# Altium schematic sheet PoE.SchDoc: Power Over Ethernet 3W
size A4; Date: 29-OCT-2015; Author: A.B; CompanyName: STMicroelectronics; Organization: MCD/TOOLS/GNB; Address1: 12, Rue Jules HOROWITZ; Address2: 38019 Grenoble; Address3: FRANCE; DocumentNumber: MB1225; Revision: B-01; SheetNumber: 11; SheetTotal: 13; Project: STM32F769I-DISCO
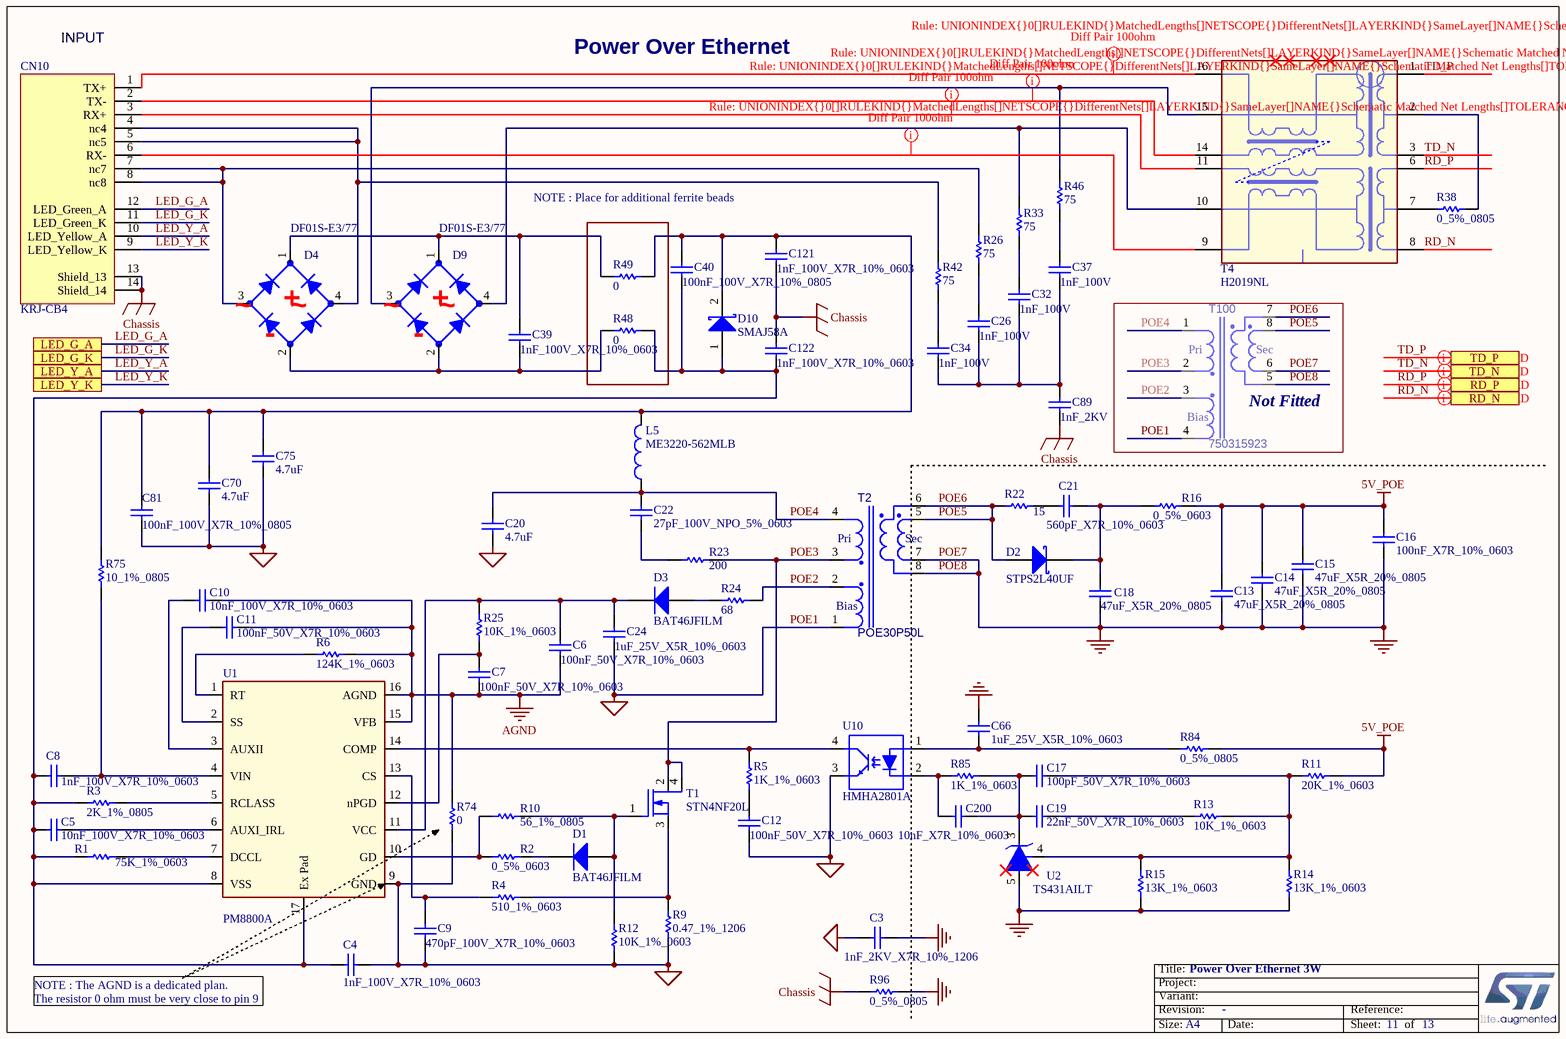
[diagram p0: PoE.SchDoc]

## Parts
C3  1nF_2KV_X7R_10%_1206  [1206C]
C4  1nF_100V_X7R_10%_0603  [0603C]
C5  10nF_100V_X7R_10%_0603  [0603C]
C6  100nF_50V_X7R_10%_0603  [0603C]
C7  100nF_50V_X7R_10%_0603  [0603C]
C8  1nF_100V_X7R_10%_0603  [0603C]
C9  470pF_100V_X7R_10%_0603  [0603C]
C10  10nF_100V_X7R_10%_0603  [0603C]
C11  100nF_50V_X7R_10%_0603  [0603C]
C12  100nF_50V_X7R_10%_0603  [0603C]
C13  47uF_X5R_20%_0805  [0805C]
C14  47uF_X5R_20%_0805  [0805C]
C15  47uF_X5R_20%_0805  [0805C]
C16  100nF_X7R_10%_0603  [0603C]
C17  100pF_50V_X7R_10%_0603  [0603C]
C18  47uF_X5R_20%_0805  [0805C]
C19  22nF_50V_X7R_10%_0603  [0603C]
C20  value 4.7uF  [C1210_H2P5]  (hidden comment: Capacitor)
C21  560pF_X7R_10%_0603  [0603C]
C22  27pF_100V_NPO_5%_0603  [0603C]
C24  1uF_25V_X5R_10%_0603  [0603C]
C26  1nF_100V  [0603C]
C32  1nF_100V  [0603C]
C34  1nF_100V  [0603C]
C37  1nF_100V  [0603C]
C39  1nF_100V_X7R_10%_0603  [0603C]
C40  100nF_100V_X7R_10%_0805  [0805C]
C66  1uF_25V_X5R_10%_0603  [0603C]
C70  value 4.7uF  [C1210_H2P5]  (hidden comment: Capacitor)
C75  value 4.7uF  [C1210_H2P5]  (hidden comment: Capacitor)
C81  100nF_100V_X7R_10%_0805  [0805C]
C89  1nF_2KV  [1206C]
C121  1nF_100V_X7R_10%_0603  [0603C]
C122  1nF_100V_X7R_10%_0603  [0603C]
C200  10nF_X7R_10%_0603  [0603C]
CN10  KRJ-CB4  [RJ45_LED_KRJ-CB4R2GYZNL_EM]
D1  BAT46JFILM  [SOD-323]
D2  STPS2L40UF  [SMB]
D3  BAT46JFILM  [SOD-323]
D4  value DF01S-E3/77  [BRF_VISHAY_DFS_DF01S]
D9  value DF01S-E3/77  [BRF_VISHAY_DFS_DF01S]
D10  SMAJ58A  [SMA]
L5  ME3220-562MLB  [LSM2_3R2X2R8_H2]
R1  75K_1%_0603  [0603R]
R2  0_5%_0603  [0603R-GS]
R3  2K_1%_0805  [0805R]
R4  510_1%_0603  [0603R]
R5  1K_1%_0603  [0603R]
R6  124K_1%_0603  [0603R]
R9  0.47_1%_1206  [1206R]
R10  56_1%_0805  [0805R]
R11  20K_1%_0603  [0603R]
R12  10K_1%_0603  [0603R]
R13  10K_1%_0603  [0603R]
R14  13K_1%_0603  [0603R]
R15  13K_1%_0603  [0603R]
R16  0_5%_0603  [0603R-GS]
R22  15  [0805R]
R23  200  [1206R]
R24  68  [0805R]
R25  10K_1%_0603  [0603R]
R26  75  [0805R]
R33  75  [0805R]
R38  0_5%_0805  [0805R]
R42  75  [0805R]
R46  75  [0805R]
R48  0  [0805R]
R49  0  [0805R]
R74  0  [0603R-GS]
R75  10_1%_0805  [0805R]
R84  0_5%_0805  [0805R]
R85  1K_1%_0603  [0603R]
R96  0_5%_0805  [0805R]
T1  STN4NF20L  [SOT-223]
T2  POE30P50L  [TF_10R9X13R2-12R2X14R4_CPT]
T4  H2019NL  [TF_16SM_12R7X9R65]
T100  750315923  [TF_8SM_12R04X12R85]
U1  PM8800A  [TSSOP16_0R65_5x6R4_TP]
U2  TS431AILT  [SOT23-5]
U10  HMHA2801A  [PC_4SM_1R27_2R5X6R8]

## Blocks framed on the sheet
Not Fitted: T100

## Ports
LED_G_A, LED_G_K, LED_Y_A, LED_Y_K, RD_N, RD_P, TD_N, TD_P

## Nets
5V_POE: C13.2 C14.2 C15.2 C16.2 R11.2 R16.2 R84.2
AGND: C6.1 C7.1 C10.2 C11.2 R6.2 R74.2 U1.15(VFB) U1.16(AGND)
Chassis: C89.1 C121.1 C122.2 CN10.13(Shield_13) CN10.14(Shield_14) R96.1
POE1: C3.1 C4.2 C9.1 C12.1 C20.1 C24.1 C70.1 C75.1 C81.1 R9.1 R12.1 R74.1 T2.1 T100.4 U1.9(GND) U10.3(Emitter)  [also labelled GND_POWER_IN]
POE7: C3.2 C13.1 C14.1 C15.1 C16.1 C18.1 C66.2 R14.1 R15.1 R96.2 T2.7 T2.8 T100.5 T100.6 U2.5(A)  [also labelled GND, POE8]
LED_G_A: CN10.12(LED_Green_A) ; port LED_G_A
LED_G_K: CN10.11(LED_Green_K) ; port LED_G_K
LED_Y_A: CN10.10(LED_Yellow_A) ; port LED_Y_A
LED_Y_K: CN10.9(LED_Yellow_K) ; port LED_Y_K
POE2: R24.2 T2.2 T100.3
POE3: R23.2 T1.2(D) T1.4(D) T2.3 T100.2
POE4: C20.2 C22.2 L5.1 T2.4 T100.1
POE5: D2.1(A) R22.1 T2.5 T2.6 T100.7 T100.8  [also labelled POE6]
RD_N: T4.8(rd-) ; port RD_N
RD_P: T4.6(rd+) ; port RD_P
TD_N: T4.3(td-) ; port TD_N
TD_P: T4.1(td+) ; port TD_P
NetC4_1: C4.1 C5.1 C8.1 C40.1 C122.1 D10.1(A) R1.1 R3.1 R48.2 U1.8(VSS) U1.17(Ex_Pad)
NetC5_2: C5.2 U1.6(AUXI_IRL)
NetC6_2: C6.2 C24.2 D3.2(K) R25.2 U1.11(VCC)
NetC7_2: C7.2 R25.1 U1.12(nPGD)
NetC8_2: C8.2 R75.1 U1.4(VIN)
NetC9_2: C9.2 R4.1 U1.13(CS)
NetC10_1: C10.1 U1.3(AUXII)
NetC11_1: C11.1 U1.2(SS)
NetC12_2: C12.2 R5.1
NetC17_1: C17.1 C19.1 C200.2 R85.2 U2.3(K)
NetC17_2: C17.2 R11.1 R13.2 R14.2 R15.2 U2.4(REF)
NetC18_2: C18.2 C21.2 D2.2(K) R16.1
NetC19_2: C19.2 R13.1
NetC21_1: C21.1 R22.2
NetC22_1: C22.1 R23.1
NetC26_1: C26.1 C32.1 C34.1 C37.1 C89.2
NetC26_2: C26.2 R26.1
NetC32_2: C32.2 R33.1
NetC34_2: C34.2 R42.1
NetC37_2: C37.2 R46.1
NetC39_1: C39.1 D4.2(DC_OUT_MINUS) D9.2(DC_OUT_MINUS) R48.1
NetC39_2: C39.2 D4.1(DC_OUT_PLUS) D9.1(DC_OUT_PLUS) R49.1
NetC40_2: C40.2 C70.2 C75.2 C81.2 C121.2 D10.2(K) L5.2 R49.2 R75.2
NetC66_1: C66.1 R84.1 U10.1(Anode)
NetC200_1: C200.1 R85.1 U10.2(B)
NetCN10_1: CN10.1(TX+) T4.16(tx1+)
NetCN10_2: CN10.2(TX-) T4.14(tx1-)
NetCN10_3: CN10.3(RX+) T4.11(rx1+)
NetCN10_4: CN10.4(nc4) CN10.5(nc5) D4.4(AC_IN_1) R42.2
NetCN10_6: CN10.6(RX-) T4.9(rx-)
NetCN10_7: CN10.7(nc7) CN10.8(nc8) D4.3(AC_IN_2) R26.2
NetD1_1: D1.1(A) R10.2 R12.2 T1.1(G)
NetD1_2: D1.2(K) R2.2
NetD3_1: D3.1(A) R24.1
NetD9_3: D9.3(AC_IN_2) R46.2 T4.15(txct)
NetD9_4: D9.4(AC_IN_1) R33.2 T4.10(rxct)
NetR1_2: R1.2 U1.7(DCCL)
NetR2_1: R2.1 R10.1 U1.10(GD)
NetR3_2: R3.2 U1.5(RCLASS)
NetR4_2: R4.2 R9.2 T1.3(S)
NetR5_2: R5.2 U1.14(COMP) U10.4(Collector)
NetR6_1: R6.1 U1.1(RT)
NetR38_1: R38.1 T4.7(rct)
NetR38_2: R38.2 T4.2(tct)

Not connected (* = marked no-connect by the designer): T4 4(nc_4)* 5(nc_5)* 12(nc_12)* 13(nc_13)*; U2 1(nc_1)* 2(nc_2)*

## Layout directives
differential pair: RD_N, RD_P, TD_N, TD_P
rule Matched Net Lengths [Tolerance = 100mil]: NetCN10_1, NetCN10_2, NetCN10_3, NetCN10_6

## Notes on the sheet
- (near CN10) INPUT
- Power Over Ethernet
- NOTE : Place for additional ferrite beads
- NOTE : The AGND is a dedicated plan.
  The resistor 0 ohm must be very close to pin 9
- Title:
- Project:
- Size:
- Revision:
- Variant:
- A4
- -
- Date:
- Reference:
- Sheet:
- of
- (in symbol MCD-02211) ~; +; -
- (in symbol POE30P_C) Pri; Sec; Bias
- (in symbol POE30P_W) Pri; Sec; Bias

## Library data of the parts
C3 C89 = Cap_1nF_2KV_X7R_10%_1206: Capacitor,1nF,2KV,X7R,10%,1206,YAGEO; Order: CC1206KKX7RDBB102; Revision: July-2002: Re-released for DXP Platform.; Value: 1nF; Manuf_1: YAGEO; Manuf_Part_1: CC1206KKX7RDBB102; ECCN_US/EU: n/a
C4 C8 C26 C32 C34 C37 C39 C121 C122 = Cap_1nF_100V_X7R_10%_0603: Capacitor,1nF,100V,X7R,10%,0603,YAGEO; Order: CC0603KRX7R0BB102; Revision: July-2002: Re-released for DXP Platform.; Value: 1nF; Manuf_1: YAGEO; Manuf_Part_1: CC0603KRX7R0BB102; ECCN_US/EU: n/a
C5 C10 = Cap_10nF_100V_X7R_10%_0603: Capacitor,10nF,100V,X7R,10%,0603,YAGEO; Manuf_Part_1: CC0603KRX7R0BB103; Revision: July-2002: Re-released for DXP Platform.; Value: 10nF; Order: CC0603KRX7R0BB103; Manuf_1: YAGEO; ECCN_US/EU: n/a
C6 C7 C11 C12 = Cap_100nF_50V_X7R_10%_0603: Capacitor,100nF,50V,X7R,10%,0603,YAGEO; Manuf_Part_1: CC0603KRX7R9BB104; Revision: July-2002: Re-released for DXP Platform.; Value: 100nF; Order: CC0603KRX7R9BB104; Manuf_1: YAGEO; ECCN_US/EU: n/a
C9 = Cap_470pF_100V_X7R_10%_0603: Capacitor,470pF,100V,X7R,10%,0603,AVX; Manuf_Part_1: 06031C471KAT2A; Revision: July-2002: Re-released for DXP Platform.; Value: 470pF; Order: 06031C471KAT2A; Manuf_1: AVX; ECCN_US/EU: n/a
C13-C15 C18 = Cap_47uF_X5R_20%_0805: Capacitor,47uF,10V,X5R,20%,0805,MURATA; Manuf_Part_1: GRM21BR61A476ME15K; Order: GRM21BR61A476ME15K-ND; Revision: July-2002: Re-released for DXP Platform.; Value: 47uF; Manuf_1: MURATA; ECCN_US/EU: n/a
C16 = Cap_100nF_X7R_10%_0603: Capacitor,100nF,16V,X7R,10%,0603,YAGEO; Manuf_Part_1: CC0603KRX7R9BB104; Revision: July-2002: Re-released for DXP Platform.; Value: 100nF; Order: CC0603KRX7R9BB104; Manuf_1: YAGEO; ECCN_US/EU: n/a
C17 = Cap_100pF_50V_X7R_10%_0603: Capacitor,100pF,50V,X7R,10%,0603,AVX; Manuf_Part_1: 06035C101JAT4A; Revision: July-2002: Re-released for DXP Platform.; Value: 100pF; Order: 06035C101JAT4A; Manuf_1: AVX; ECCN_US/EU: n/a
C19 = Cap_22nF_50V_X7R_10%_0603: Capacitor,22nF,50V,X7R,10%,0603,YAGEO; Manuf_Part_1: CC0603KRX7R9BB223; Revision: July-2002: Re-released for DXP Platform.; Value: 22nF; Order: CC0603KRX7R9BB223; Manuf_1: YAGEO; ECCN_US/EU: n/a
C20 C70 C75 = MCD-02212: Capacitor, MLCC, 4.7uF, 100V, X7S, +/-10%, 1210 , T=2.5mm; Part_Preference: Recommended; Manufacturer: TDK; Manufacturer_Part_Number: CGA6M3X7S2A475K200AB; Order_Code_RS: 111-0119; Internal_Part_Number: MCD-02212; Status: Checked; Part_Type: Capacitor; Alternate_Manufacturer: N/A; Alternate_Manufacturer_Part_Number: N/A; Package: 1210; ComponentLink1URL: http://tunmcdsvn.tun.st.com/Component_Documentation_Library/Trunk/Capacitor/TDK_CGA_Series; Order_Code_Digikey: 445-7005-1-ND; Order_Code_Farnell: 2211140RL
C21 = Cap_560pF_X7R_10%_0603: Capacitor,560pF,16V,X7R,10%,0603,AVX; Manuf_Part_1: 0603YC561KAT2A; Revision: July-2002: Re-released for DXP Platform.; Value: 560pF; Order: 0603YC561KAT2A; Manuf_1: AVX; ECCN_US/EU: n/a
C22 = Cap_27pF_100V_NPO_5%_0603: Capacitor,27pF,100V,NPO,5%,0603,YAGEO; Manuf_Part_1: CC0603JRNPO0BN270; Manuf_2: AVX; Manuf_Part_2: 06031A270JAT2A; Fitted: NO; Revision: July-2002: Re-released for DXP Platform.; Value: 27pF; Manuf_1: YAGEO; ECCN_US/EU: n/a
C24 C66 = Cap_1uF_25V_X5R_10%_0603: Capacitor,1uF,25V,X5R,10%,0603,YAGEO; Manuf_Part_1: CC0603KRX5R8BB105; Revision: July-2002: Re-released for DXP Platform.; Value: 1uF; Order: CC0603KRX5R8BB105; Manuf_1: YAGEO; ECCN_US/EU: n/a
C40 C81 = Cap_100nF_100V_X7R_10%_0805: Capacitor,100nF,100V,X7R,10%,0805,TDK; Order: C2012X7R2A104K125AA; Revision: July-2002: Re-released for DXP Platform.; Value: 100nF; Manuf_1: TDK; Manuf_Part_1: C2012X7R2A104K125AA; ECCN_US/EU: n/a
C200 = Cap_10nF_X7R_10%_0603: Capacitor,10nF,50V,X7R,10%,0603,YAGEO; Manuf_Part_1: CC0603KRX7R9BB103; Revision: July-2002: Re-released for DXP Platform.; Value: 10nF; Order: CC0603KRX7R9BB103; Manuf_1: YAGEO; ECCN_US/EU: n/a
CN10 = KRJ-CB4: 100 Base-TX (Fast Ethernet)  RJ45 single port (1x1) with LEDS Integrated Connector; Manuf_1: DGKYD; Manuf_Part_1: KRJ-CB4.2GYZNL; Distrib: Sub Co; Ref St: *; ECCN_US/EU: n/a
D1 D3 = BAT46JFILM: Schottky Single diode(150mA, 100V); Manuf_1: STM; Provided: ST; ECCN_US/EU: EAR99/NEC; Ref St: 9151125; Revision: July-2002: Re-released for DXP Platform.; Order: BAT46JFILM; Manuf_Part_1: BAT46JFILM; Distrib: ST
D2 = STPS2L40UF: Low drop power Schottky rectifier(2A, 40V, 0.34V); Manuf_1: STM; Order: STPS2L40AF; Provided: ST; ECCN_US/EU: EAR99/NEC; Code - JEDEC: ******; Note: SMB footprint will accept STPS2L40U/UF/AF; Ref St: 9151009; Manuf_Part_1: STPS2L40UF; Distrib: ST; Manuf_Part_2: STPS2L40U; Manuf_Part_3: STPS2L40AF
D4 D9 = MCD-02211: Surface Mount Bridge Rectifier 1A 100V; Part_Preference: Recommended; Part_Type: IC; Manufacturer: VISHAY; Internal_Part_Number: MCD-02211; Status: Checked; Manufacturer_Part_Number: DF01S-E3/77; Alternate_Manufacturer: N/A; Alternate_Manufacturer_Part_Number: N/A; Package: DFS; ComponentLink1Description: Part_Information; ComponentLink1URL: http://tunmcdsvn.tun.st.com/Component_Datasheet_Library/Trunk/IC/Vishay_Rectifiers_DF01S/Vishay_Rectifiers_DF01S.pdf
D10 = SMAJ58A: Transil 400W, VRM=58V; Manuf_1: STM; Manuf_Part_1: SMAJ58A-TR; ECCN_US/EU: EAR99/NEC; Provided: ST; Ref St: 9151124; Order: SMAJ58A-TR; Distrib: ST
L5 = ME3220-562ML: Power Inductor, 5.6uH, 0.2R, ME3220-562ML, CoilCraft; Manuf_2: Cyntec; Manuf_Part_2: SDET32251E-5R6MS-11; Revision: July-2002: Re-released for DXP Platform.; Value: 5.6uH; Manuf_Part_1: ME3220-562ML; Manuf_1: CoilCraft; Description_2: Power Inductor, 5.6uH, 0.2R, ME3220-562ML, CoilCraft; ECCN_US/EU: n/a
R1 = Res_75K_1%_0603: Resistor,75K,0603,1%,YAGEO; Manuf_Part_1: RC0603FR-0775KL; Value: 75K; ECCN_US/EU: n/a; Manuf_1: YAGEO; Distrib: Sub Co; Order: RC0603FR-0775KL
R2 R16 = Res_0_5%_0603: Resistor,0,0603,5%,YAGEO; Manuf_Part_1: RC0603JR-070RL; Value: 0; Order: 2363481; ECCN_US/EU: n/a; Manuf_1: YAGEO; Distrib: FARNELL
R3 = Res_2K_1%_0805: Resistor,2K,0805,1%,YAGEO; Manuf_Part_1: RC0805FR-072KL; Manuf_Part_2: RT0805FRE072KL; Value: 2K; Manuf_1: YAGEO; ECCN_US/EU: n/a
R4 = Res_510_1%_0603: Resistor,510,0603,1%,YAGEO; Manuf_Part_1: RC0603FR-07510RL; Value: 510; Manuf_1: YAGEO; Order: RC0603FR-07510RL; ECCN_US/EU: n/a; Distrib: Sub Co
R5 R85 = Res_1K_1%_0603: Resistor,1K,0603,1%,YAGEO; Manuf_Part_1: RC0603FR-071KL; Value: 1K; Manuf_1: YAGEO; Order: RC0603FR-071KL; ECCN_US/EU: n/a
R6 = Res_124K_1%_0603: Resistor,124K,0603,1%,YAGEO; Manuf_Part_1: RC0603FR-07124KL; Value: 124K; ECCN_US/EU: n/a; Manuf_1: YAGEO; Distrib: Sub Co; Order: RC0603FR-07124KL
R9 = Res_0.47_1%_1206: Resistor,0.47,1206,1%,YAGEO; Manuf_Part_1: RL1206FR-070R47L; Manuf_Part_2: LTR18EZPFLR470; Manuf_2: Rohm Semiconductor; Value: 0.47; Manuf_1: YAGEO; ECCN_US/EU: n/a
R10 = Res_56_1%_0805: Resistor,56,0805,1%,YAGEO; Manuf_Part_1: RC0805FR-0756RL; Value: 56; Order: 311-56.0CRTR-ND; Manuf_1: YAGEO; ECCN_US/EU: n/a; Distrib: DIGIKEY
R11 = Res_20K_1%_0603: Resistor,20K,0603,1%,YAGEO; Manuf_Part_1: RC0603FR-0720KL; Value: 20K; Manuf_1: YAGEO; Order: RC0603FR-0720KL; ECCN_US/EU: n/a
R12 R13 R25 = Res_10K_1%_0603: Resistor,10K,0603,1%,YAGEO; Manuf_Part_1: RC0603FR-0710KL; Value: 10K; Manuf_1: YAGEO; Order: RC0603FR-0710KL; ECCN_US/EU: n/a
R14 R15 = Res_13K_1%_0603: Resistor,13K,0603,1%,YAGEO; Manuf_Part_1: RC0603FR-0713KL; Value: 13K; Manuf_1: YAGEO; Order: RC0603FR-0713KL; ECCN_US/EU: n/a; Distrib: Sub Co
R22 = Res_15_1%_0805: Resistor,15,0805,1%,YAGEO; Manuf_Part_1: RC0805FR-0715RL; Value: 15; Manuf_1: YAGEO; Order: RC0805FR-0715RL; ECCN_US/EU: n/a
R23 = Res_200_1%_1206: Resistor,200,1206,1%,Rohm; Manuf_Part_1: LTR18EZPF2000; Manuf_1: Rohm Semiconductor; Fitted: NO; Value: 200; Order: LTR18EZPF2000; ECCN_US/EU: n/a
R24 = Res_68_1%_0805: Resistor,68,0805,1%,YAGEO; Manuf_Part_1: RC0805FR-0768RL; Value: 68; Manuf_1: YAGEO; Order: RC0805FR-0768RL; ECCN_US/EU: n/a
R26 R33 R42 R46 = Res_75_1%_0805: Resistor,75,0805,1%,YAGEO; Manuf_Part_1: RC0805FR-0775RL; Order: 311-75.0CRTR-ND; Value: 75; Manuf_1: YAGEO; ECCN_US/EU: n/a; Distrib: DIGIKEY
R38 = Res_0_5%_0805: Resistor,0,0805,5%,YAGEO; Manuf_Part_1: RC0805JR-070RL; Value: 0; Order: 2363489; Fitted: NO; ECCN_US/EU: n/a; Manuf_1: YAGEO
R48 R49 = Res_0_5%_0805: Resistor,0,0805,5%,YAGEO; Manuf_Part_1: RC0805JR-070RL; Order: 2363489; Value: 0; ECCN_US/EU: n/a; Manuf_1: YAGEO
R74 = Res_0_5%_0603: Resistor,0,0603,5%,YAGEO; Manuf_Part_1: RC0603JR-070RL; Order: 2363481; Value: 0; ECCN_US/EU: n/a; Manuf_1: YAGEO; Distrib: FARNELL
R75 = Res_10_1%_0805: Resistor,10,0805,1%,Stackpole,1/4W; Manuf_Part_1: RNCP0805FTD10R0; Manuf_1: Stackpole Electronics Inc; Value: 10; Order: RNCP0805FTD10R0; ECCN_US/EU: n/a
R84 R96 = Res_0_5%_0805: Resistor,0,0805,5%,YAGEO; Manuf_Part_1: RC0805JR-070RL; Value: 0; Order: 2363489; ECCN_US/EU: n/a; Manuf_1: YAGEO
T1 = STN4NF20L: N-channel 200 V, 1.1ohm, 1 A, low gate charge STripFET II, Power MOSFET; Manuf_2: Fairchild; Manuf_Part_2: FDN86246; Manuf_1: ST; ECCN_US/EU: EAR99/NEC; Ref St: 9153018; Manuf_Part_1: STN4NF20L; Provided: ST
T2 = POE30P_C: Flyback Transformers for 3 Watt, PoE applications, CoilCraft Cyntec; Manuf_Part_1: POEP30P50L; Manuf_Part_2: 86H-15181; Provided: Sub Co; Note: for Cyntec, Secondary 6, 7 removed; Manuf_1: CoilCraft; ECCN_US/EU: n/a; Manuf_2: Cyntec
T4 = H2019: 10/100BASE-TX VoIP Magnetics Modules, Data Transformer; Manuf_Part_2: TLA-6T127LF, with different pinout; Manuf_1: PULSE; Manuf_2: TDK; Manuf_Part_3: KMS-1102NL; Manuf_3: DGKYD; Double foot print: TLA-6T127LF, pin 10, 12, 13, 15 differents; ECCN_US/EU: EAR99/NEC; Manuf_Part_1: H2019NL
T100 = POE30P_W: Flyback Transformers for 3 Watt, PoE applications, Wurth; Provided: Sub Co; Note: Compatible with CoilCraft but swap pins 1 and 4, pins 2 and 3, pins 5 and 8, pins 6 and 7; Fitted: NO; Manuf_1: Wurth; Manuf_Part_1: 750315923; ECCN_US/EU: n/a
U1 = PM8800A: Integrated IEEE 802.3af compliant PoE-PD interface, and PWM controller with support of external source; Manuf_Part_1: PM8800ATR; Manuf_1: ST; Provided: STM; ECCN_US/EU: EAR99/NEC; Ref St: 9177966; Distrib: ST
U2 = TS431AILT: Low voltage adjustable shunt reference; Manuf_1: ST; ECCN_US/EU: EAER99/NEC; Ref St: 9177032; Manuf_Part_1: TS431AILT; Provided: ST
U10 = HMHA2801A: OPTOISOLATOR 3.7KV TRANSISTOR 4SMD; Manuf_1: FAIRCHILD; Order: HMHA2801A-ND; ECCN_US/EU: EAR99/NEC; Manuf_Part_1: HMHA2801A; Distrib: DIGIKEY